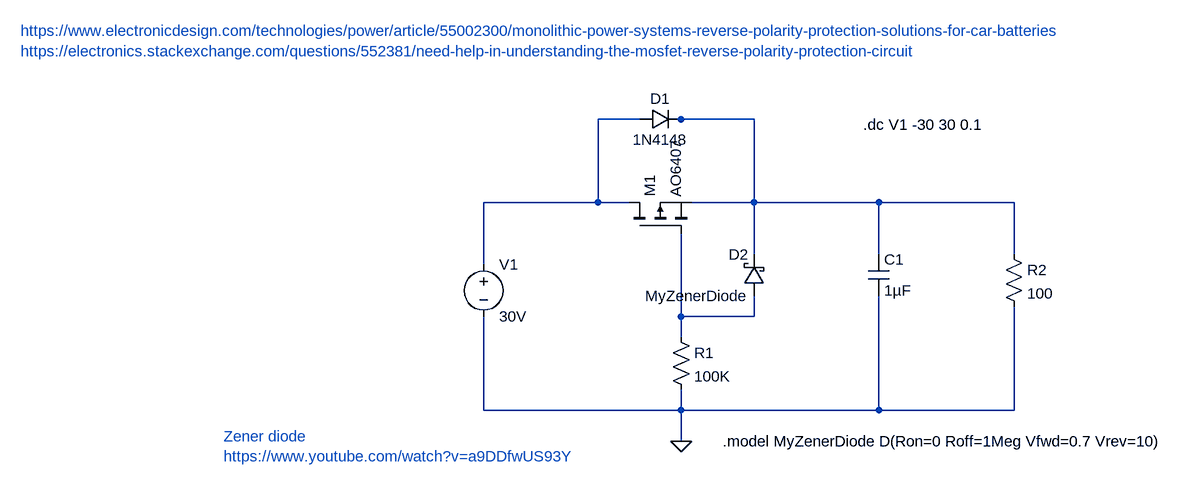
[diagram p0: schematic p_mosfet_reverse_polarity_protection.asc]
p_mosfet_reverse_polarity_protection.asc, the LTspice schematic file:
Version 4
SHEET 1 1736 692
WIRE 848 160 784 160
WIRE 912 160 896 160
WIRE 1024 160 912 160
WIRE 784 288 784 160
WIRE 784 288 608 288
WIRE 832 288 784 288
WIRE 1024 288 1024 160
WIRE 1024 288 928 288
WIRE 1216 288 1024 288
WIRE 1424 288 1216 288
WIRE 1024 368 1024 288
WIRE 1216 368 1216 288
WIRE 1424 368 1424 288
WIRE 608 384 608 288
WIRE 912 464 912 336
WIRE 1024 464 1024 432
WIRE 1024 464 912 464
WIRE 912 496 912 464
WIRE 608 608 608 464
WIRE 912 608 912 576
WIRE 912 608 608 608
WIRE 1216 608 1216 432
WIRE 1216 608 912 608
WIRE 1424 608 1424 448
WIRE 1424 608 1216 608
WIRE 912 656 912 608
FLAG 912 656 0
SYMBOL pmos 832 336 R270
SYMATTR InstName M1
SYMATTR Value AO6407
SYMBOL diode 848 176 R270
WINDOW 0 32 32 VTop 2
WINDOW 3 0 32 VBottom 2
SYMATTR InstName D1
SYMATTR Value 1N4148
SYMBOL schottky 1040 432 R180
WINDOW 0 24 64 Left 2
WINDOW 3 24 0 Left 2
SYMATTR InstName D2
SYMATTR Value MyZenerDiode
SYMBOL res 896 480 R0
SYMATTR InstName R1
SYMATTR Value 100K
SYMBOL res 1408 352 R0
SYMATTR InstName R2
SYMATTR Value 100
SYMBOL cap 1200 368 R0
SYMATTR InstName C1
SYMATTR Value 1µF
SYMBOL voltage 608 368 R0
WINDOW 123 0 0 Left 0
WINDOW 39 0 0 Left 0
SYMATTR InstName V1
SYMATTR Value 30V
TEXT -104 24 Left 2 ;https://www.electronicdesign.com/technologies/power/article/55002300/monolithic-power-systems-reverse-polarity-protection-solutions-for-car-batteries\nhttps://electronics.stackexchange.com/questions/552381/need-help-in-understanding-the-mosfet-reverse-polarity-protection-circuit
TEXT 1192 168 Left 2 !.dc V1 -30 30 0.1
TEXT 976 656 Left 2 !.model MyZenerDiode D(Ron=0 Roff=1Meg Vfwd=0.7 Vrev=10)
TEXT 208 648 Left 2 ;Zener diode\nhttps://www.youtube.com/watch?v=a9DDfwUS93Y

The netlist it stands for:
* p_mosfet_reverse_polarity_protection.asc
M1 N001 N003 N002 N002 AO6407
D1 N001 N002 1N4148
D2 N003 N002 MyZenerDiode
R1 N003 0 100K
R2 N002 0 100
C1 N002 0 1µF
V1 N001 0 30V
.model D D
.lib standard.dio
.model NMOS NMOS
.model PMOS PMOS
.lib standard.mos
* https://www.electronicdesign.com/technologies/power/article/55002300/monolithic-power-systems-reverse-polarity-protection-solutions-for-car-batteries
* https://electronics.stackexchange.com/questions/552381/need-help-in-understanding-the-mosfet-reverse-polarity-protection-circuit
.dc V1 -30 30 0.1
.model MyZenerDiode D(Ron=0 Roff=1Meg Vfwd=0.7 Vrev=10)
* Zener diode
* https://www.youtube.com/watch?v=a9DDfwUS93Y
.backanno
.end